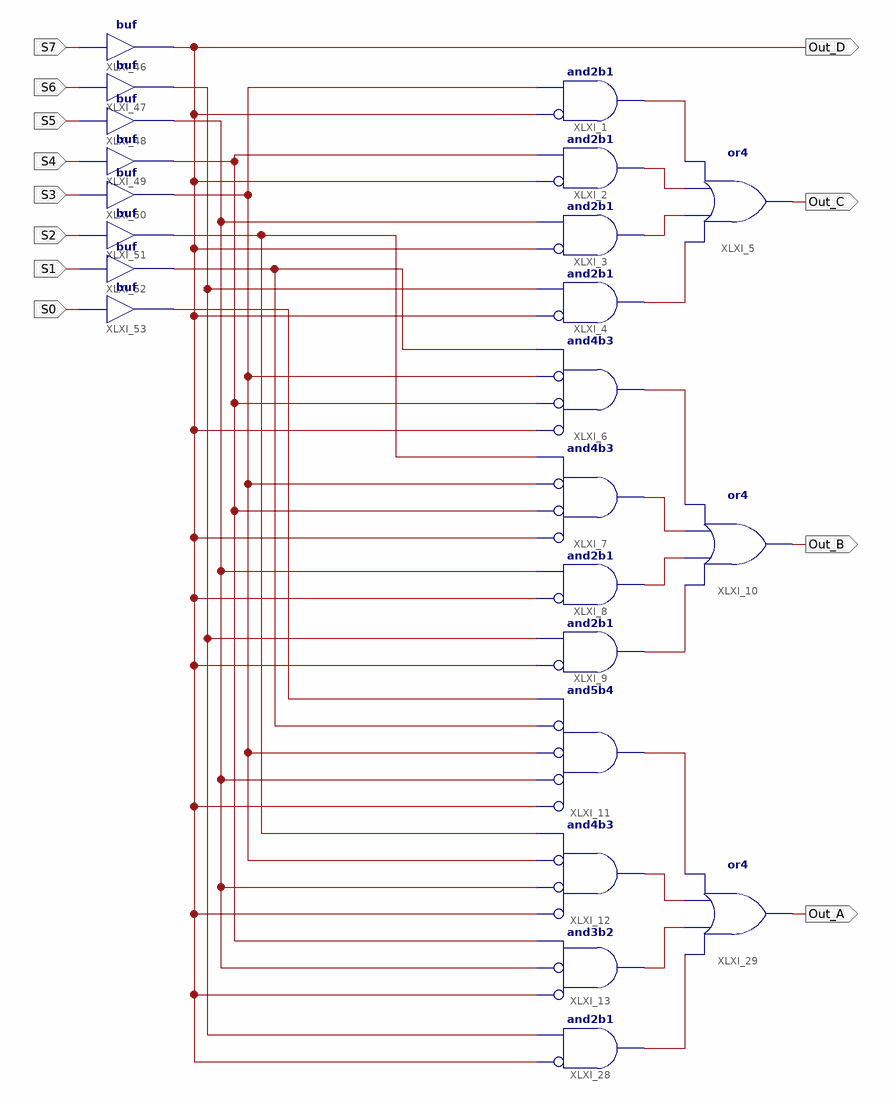
[diagram p0: schematic sheet 1]
// Xilinx ISE schematic Priority_Encoder_8to4.sch (spartan6) as structural Verilog: 23 symbols, 12 ports
module Priority_Encoder_8to4 (
  input  S7,
  input  S6,
  input  S5,
  input  S4,
  input  S3,
  input  S2,
  input  S1,
  input  S0,
  output Out_D,
  output Out_C,
  output Out_B,
  output Out_A
);

  wire XLXN_11, XLXN_12, XLXN_13, XLXN_14, XLXN_15, XLXN_16, XLXN_18, XLXN_19, XLXN_28, XLXN_29, XLXN_30,
       XLXN_31, XLXN_54, XLXN_65, XLXN_68, XLXN_69, XLXN_70, XLXN_102, XLXN_104;

  and XLXI_3 (XLXN_12, ~Out_D, XLXN_65);  // and2b1
  and XLXI_2 (XLXN_11, ~Out_D, XLXN_102);  // and2b1
  and XLXI_1 (XLXN_14, ~Out_D, XLXN_104);  // and2b1
  and XLXI_4 (XLXN_13, ~Out_D, XLXN_54);  // and2b1
  or XLXI_5 (Out_C, XLXN_13, XLXN_12, XLXN_11, XLXN_14);
  and XLXI_6 (XLXN_15, ~Out_D, ~XLXN_102, ~XLXN_104, XLXN_69);  // and4b3
  and XLXI_7 (XLXN_16, ~Out_D, ~XLXN_102, ~XLXN_104, XLXN_68);  // and4b3
  and XLXI_8 (XLXN_18, ~Out_D, XLXN_65);  // and2b1
  and XLXI_9 (XLXN_19, ~Out_D, XLXN_54);  // and2b1
  or XLXI_10 (Out_B, XLXN_19, XLXN_18, XLXN_16, XLXN_15);
  and XLXI_11 (XLXN_31, ~Out_D, ~XLXN_65, ~XLXN_104, ~XLXN_69, XLXN_70);  // and5b4
  and XLXI_12 (XLXN_28, ~Out_D, ~XLXN_65, ~XLXN_104, XLXN_68);  // and4b3
  and XLXI_13 (XLXN_29, ~Out_D, ~XLXN_65, XLXN_102);  // and3b2
  and XLXI_28 (XLXN_30, ~Out_D, XLXN_54);  // and2b1
  or XLXI_29 (Out_A, XLXN_30, XLXN_29, XLXN_28, XLXN_31);
  buf XLXI_46 (Out_D, S7);
  buf XLXI_47 (XLXN_54, S6);
  buf XLXI_48 (XLXN_65, S5);
  buf XLXI_49 (XLXN_102, S4);
  buf XLXI_50 (XLXN_104, S3);
  buf XLXI_51 (XLXN_68, S2);
  buf XLXI_52 (XLXN_69, S1);
  buf XLXI_53 (XLXN_70, S0);
endmodule
